# EAGLE design H12R10 (EAGLE 9.6.2)

## Sheet 1 of 2
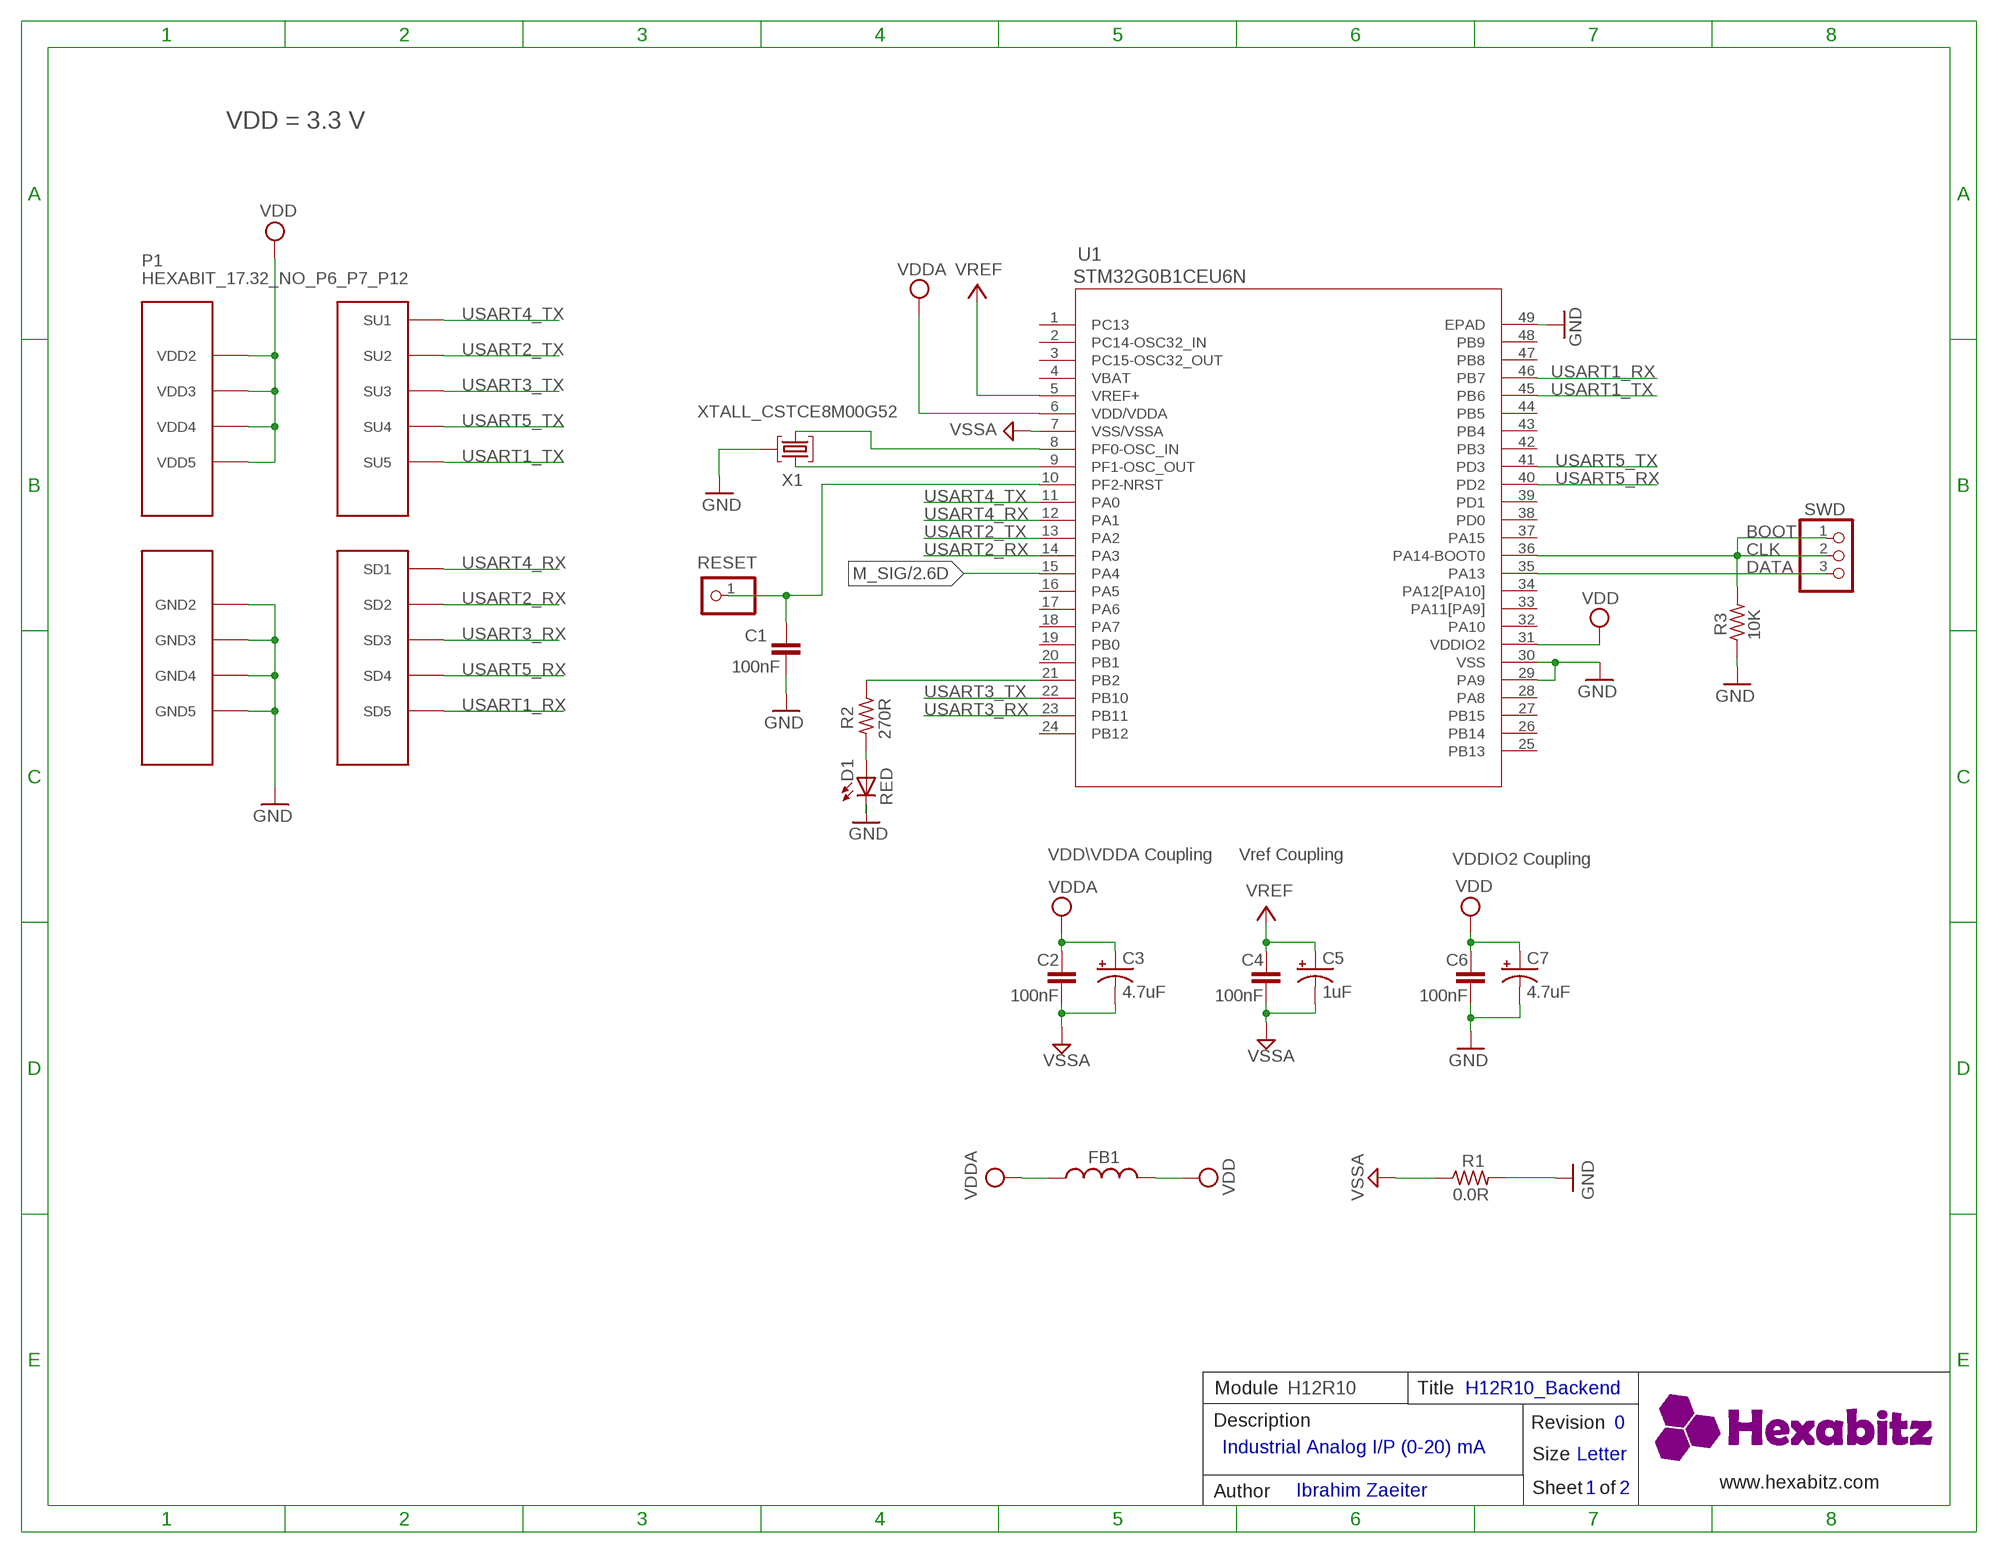
[diagram p0: schematic, sheet 1]

### Parts
C1  100nF  C-0603  [C-0603]
C2  100nF  C-0603  [C-0603]
C3  4.7uF  C-0805-POL  [C-0805-POL]
C4  100nF  C-0603  [C-0603]
C5  1uF  C-0805-POL  [C-0805-POL]
C6  100nF  C-0603  [C-0603]
C7  4.7uF  C-0805-POL  [C-0805-POL]
D1  RED  VLMS1300-GS08  [VLMS1300-GS08]
FB1  FB-0603  [FB-0603]
P1  HEXABIT_17.32_NO_P6_P7_P12  [HEXABIT_17.32_NO_P6_P7_P12]
R1  0.0R  R-0603  [R-0603]
R2  270R  R-0603  [R-0603]
R3  10K  R-0603  [R-0603]
RESET  R  PINHD-1X1  [1X01]
SWD  PINHD-1X3SWD  [SWD]
U1  STM32G0B1CEU6N  [HEXABITZ_ICS_QFN_B1CEU6_STM-L]
X1  XTALL_CSTCE8M00G52  [XTALL_CSTCE8M00G52]

### Nets
CLK: R3.2 SWD.1 SWD.2 U1.36(PA14-BOOT0)
DATA: SWD.3 U1.35(PA13)
GND: C1.2 C6.2 C7.2(-) D1.C P1.PAD_PD8(GND2) P1.PAD_PD9(GND3) P1.PAD_PD10(GND4) P1.PAD_PD11(GND5) R1.2 R3.1 U1.29(PA9) U1.30(VSS) U1.49(EPAD) X1.P$2
M_SIG: U1.15(PA4) ; also sheet 2
N$1: D1.A R2.2
N$4: R2.1 U1.21(PB2)
N$5: U1.9(PF1-OSC_OUT) X1.P$1
N$6: U1.8(PF0-OSC_IN) X1.P$3
N$8: C1.1 RESET.1 U1.10(PF2-NRST)
USART1_RX: P1.PAD_PD5(SD5) U1.46(PB7)
USART1_TX: P1.PAD_PU5(SU5) U1.45(PB6)
USART2_RX: P1.PAD_PD2(SD2) U1.14(PA3)
USART2_TX: P1.PAD_PU2(SU2) U1.13(PA2)
USART3_RX: P1.PAD_PD3(SD3) U1.23(PB11)
USART3_TX: P1.PAD_PU3(SU3) U1.22(PB10)
USART4_RX: P1.PAD_PD1(SD1) U1.12(PA1)
USART4_TX: P1.PAD_PU1(SU1) U1.11(PA0)
USART5_RX: P1.PAD_PD4(SD4) U1.40(PD2)
USART5_TX: P1.PAD_PU4(SU4) U1.41(PD3)
VDD: C6.1 C7.1(+) FB1.2 P1.PAD_PU8(VDD2) P1.PAD_PU9(VDD3) P1.PAD_PU10(VDD4) P1.PAD_PU11(VDD5) U1.31(VDDIO2)
VDDA: C2.1 C3.1(+) FB1.1 U1.6(VDD/VDDA) ; also sheet 2
VREF: C4.1 C5.1(+) U1.5(VREF+) ; also sheet 2
VSSA: C2.2 C3.2(-) C4.2 C5.2(-) R1.1 U1.7(VSS/VSSA) ; also sheet 2
Unconnected: U1.1(PC13) U1.2(PC14-OSC32_IN) U1.3(PC15-OSC32_OUT) U1.16(PA5) U1.17(PA6) U1.18(PA7) U1.19(PB0) U1.20(PB1) U1.24(PB12) U1.25(PB13) U1.26(PB14) U1.27(PB15) U1.28(PA8) U1.32(PA10) U1.33(PA11[PA9]) U1.34(PA12[PA10]) U1.37(PA15) U1.38(PD0) U1.39(PD1) U1.42(PB3) U1.43(PB4) U1.44(PB5) U1.47(PB8) U1.48(PB9)

### Notes on the sheet
- VDD = 3.3 V
- BOOT
- VDD\VDDA Coupling | Vref Coupling | VDDIO2 Coupling
- Module | H12R10 | Title | H12R10_Backend
- Description | Revision | 0
- Industrial Analog I/P (0-20) mA
- Size | Letter
- www.hexabitz.com
- Author | Ibrahim Zaeiter | Sheet   of | 1 | 2
- C:/Users/Admin/Desktop/logodraft.bmp

## Sheet 2 of 2
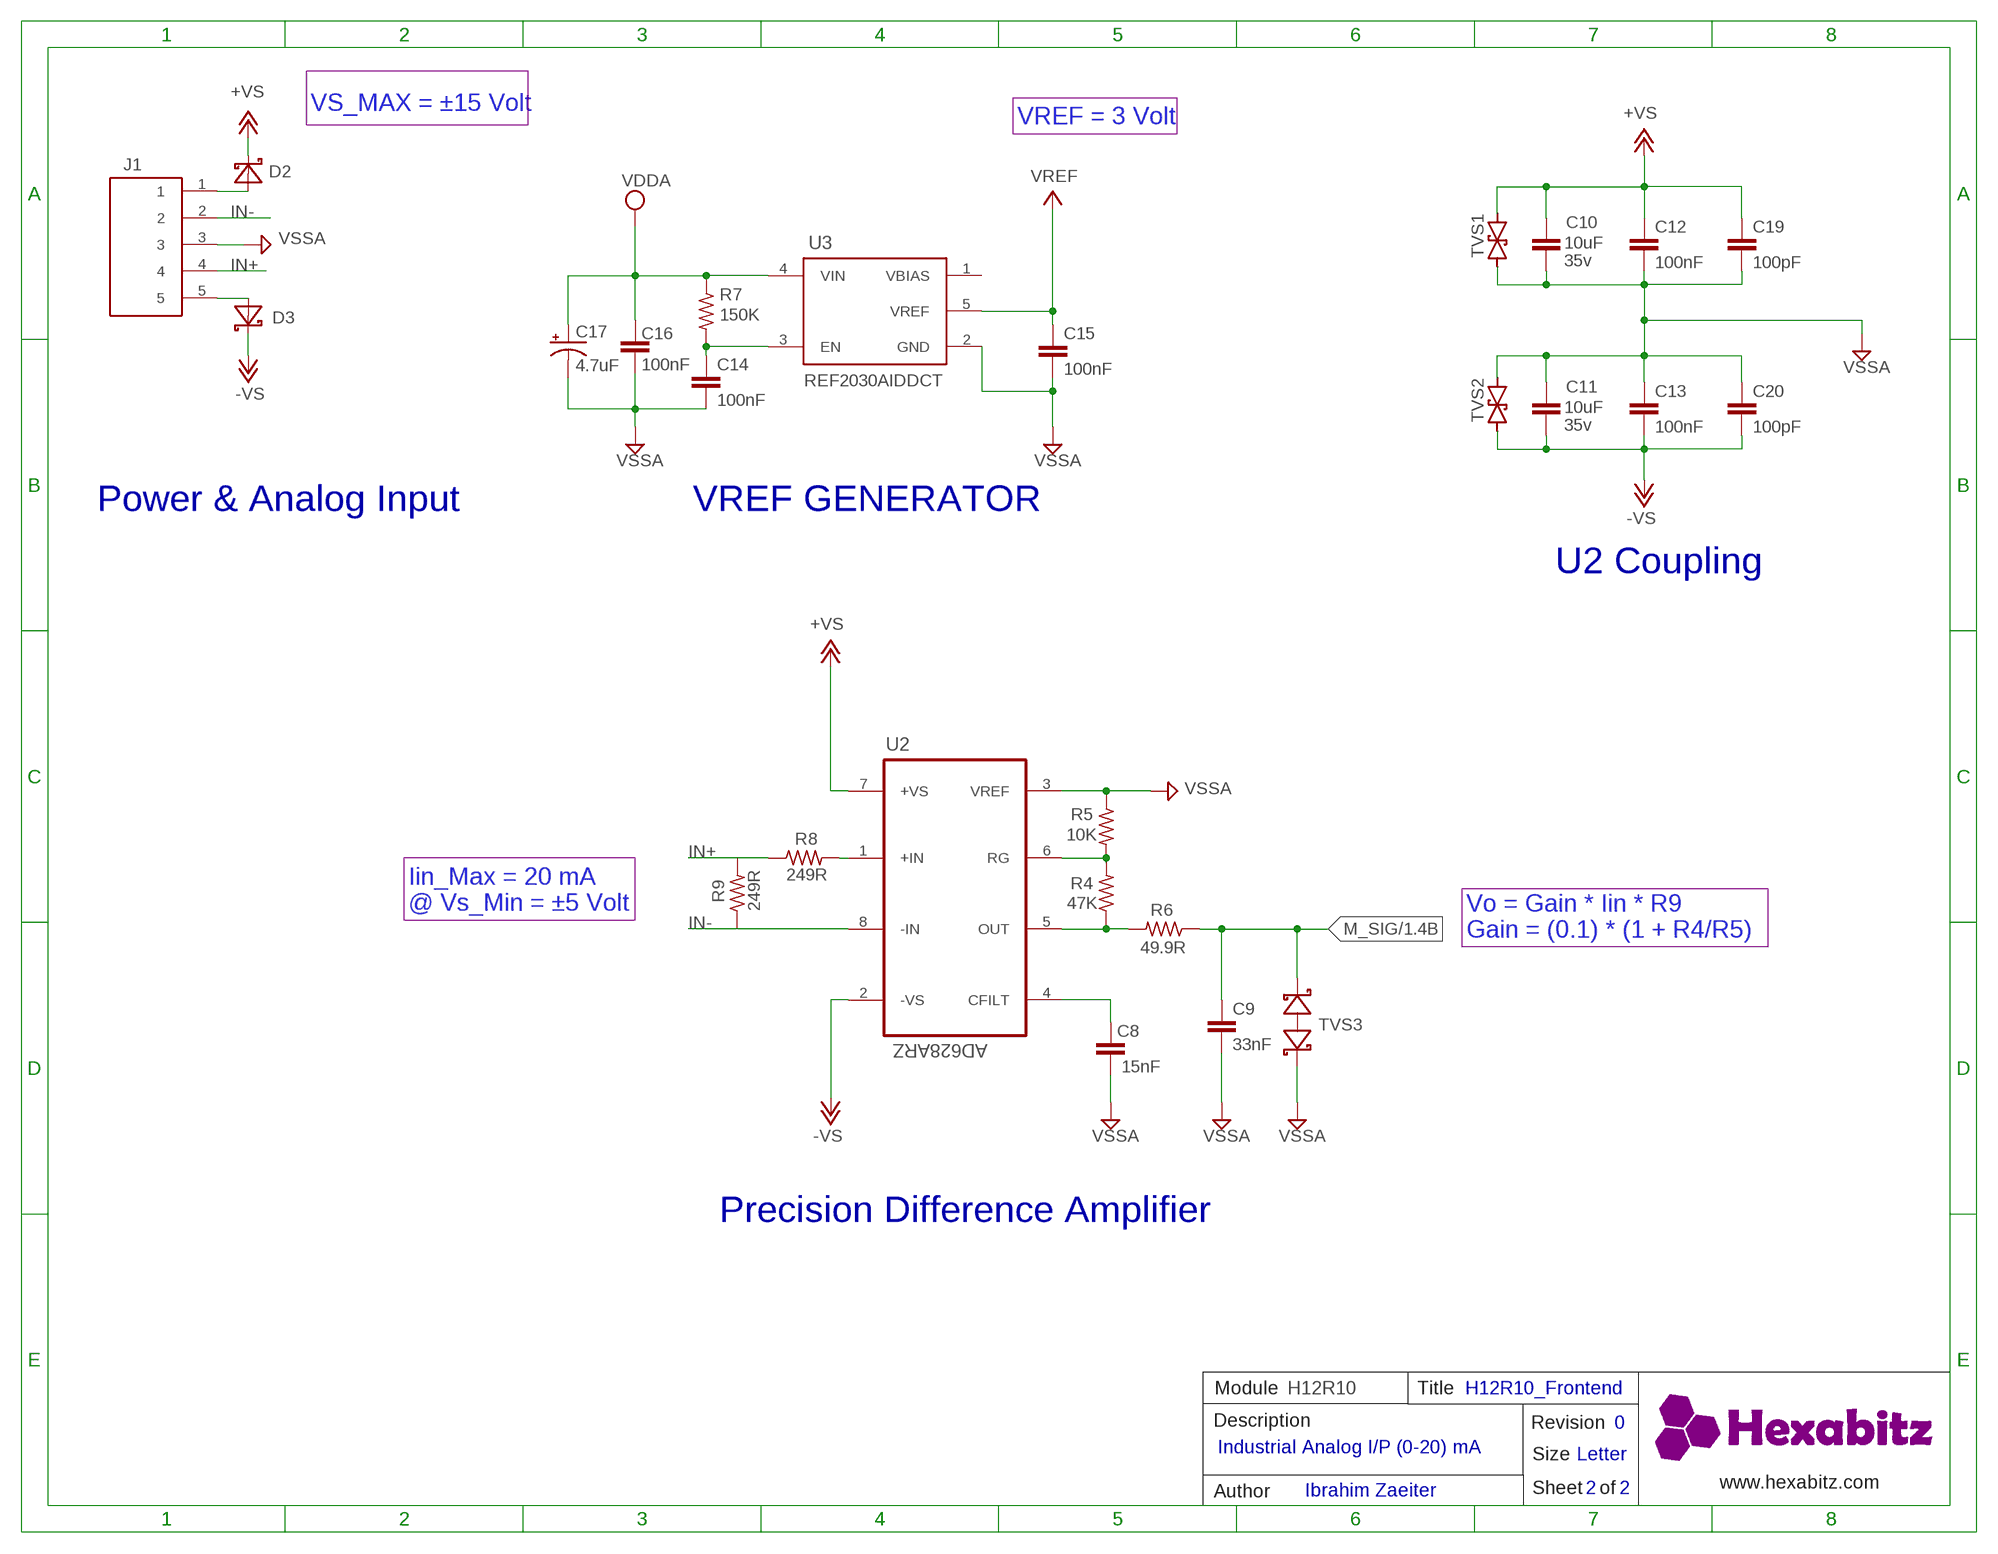
[diagram p1: schematic, sheet 2]

### Parts
C8  15nF  C-0603  [C-0603]
C9  33nF  C-0603  [C-0603]
C10  C-0805  [C-0805]
C11  C-0805  [C-0805]
C12  100nF  C-0603  [C-0603]
C13  100nF  C-0603  [C-0603]
C14  100nF  C-0603  [C-0603]
C15  100nF  C-0603  [C-0603]
C16  100nF  C-0603  [C-0603]
C17  4.7uF  C-0805-POL  [C-0805-POL]
C19  100pF  C-0603  [C-0603]
C20  100pF  C-0603  [C-0603]
D2  DIOD-SOD-123  [SOD123]
D3  DIOD-SOD-123  [SOD123]
J1  1984646  [1984646]
R4  47K  R-0603  [R-0603]
R5  10K  R-0603  [R-0603]
R6  49.9R  R-0603  [R-0603]
R7  150K  R-0603  [R-0603]
R8  249R  R-0603  [R-0603]
R9  249R  R-0603  [R-0603]
TVS1  SMBJ30CA  [DO214AA]
TVS2  SMBJ30CA  [DO214AA]
TVS3  BOURNS_CDSOD323-T03SCBOURNS_CDSOD323-T03SC_0_0  [BOURNS_CDSOD323-T03SC_0]
U2  AD628ARZ  [SOIC127P600X175-8N]
U3  TEXAS_INSTRUMENTS_REF2033AIDDCRTEXAS_INSTRUMENTS_REF2033AIDDCR_0_2  [TEXAS_INSTRUMENTS_REF2033AIDDCR_2]

### Nets
+VS: C10.1 C12.1 C19.1 D2.2(C) TVS1.C U2.7(+VS)
-VS: C11.2 C13.2 C20.2 D3.2(C) TVS2.A U2.2(-VS)
CFILT: C8.1 U2.4(CFILT)
IN+: J1.4 R8.1 R9.2
IN-: J1.2 R9.1 U2.8(-IN)
M_SIG: C9.1 R6.1 TVS3.2(C) ; also sheet 1
N$2: D3.1(A) J1.5
N$3: D2.1(A) J1.1
N$9: C14.1 R7.2 U3.3(EN)
N$10: R8.2 U2.1(+IN)
OUT: R4.1 R6.2 U2.5(OUT)
RG: R4.2 R5.2 U2.6(RG)
VDDA: C16.1 C17.1(+) R7.1 U3.4(VIN) ; also sheet 1
VREF: C15.1 U3.5(VREF) ; also sheet 1
VSSA: C8.2 C9.2 C10.2 C11.1 C12.2 C13.1 C14.2 C15.2 C16.2 C17.2(-) C19.2 C20.1 J1.3 R5.1 TVS1.A TVS2.C TVS3.1(A) U2.3(VREF) U3.2(GND) ; also sheet 1

### Notes on the sheet
- VS_MAX = ±15 Volt
- VREF = 3 Volt
- Power & Analog Input | VREF GENERATOR
- U2 Coupling
- Iin_Max = 20 mA
  @ Vs_Min = ±5 Volt
- Vo = Gain * Iin * R9
  Gain = (0.1) * (1 + R4/R5)
- Precision Difference Amplifier
- Module | H12R10 | Title | H12R10_Frontend
- Description | Revision | 0
- Industrial Analog I/P (0-20) mA
- Size | Letter
- www.hexabitz.com
- Author | Ibrahim Zaeiter | Sheet   of | 2 | 2
- C:/Users/Admin/Desktop/logodraft.bmp

## Power pins joined to a net without a drawn wire
VBAT: U1.4(VBAT)
VBIAS: U3.1(VBIAS)

## Library data of the parts
C1 C2 C4 C6 C8 C9 C14-C16 = HEXABITZ_RCLS:C-0603: CAP CER 10% X7R 0603
C3 C5 C7 C17 = HEXABITZ_RCLS:C-0805-POL: Cap Tant Solid SMD 2012
C10 C11 = HEXABITZ_RCLS:C-0805: CAP CER 10% X7R 0805; CAPACITANCE: 10uF; MPN: GRM21BR6YA106ME43K; VOLTAGE_RATING: 35v
C12 C13 C19 C20 = HEXABITZ_RCLS:C-0603: CAP CER 10% X7R 0603; MPN: C1608X7R1H104K080AA
D1 = Hexabitz:VLMS1300-GS08: Red 0603 130° Clear 54 mcd 2 V Surface Mount ChipLED ; Octopart Url : http://octopart.com/vlms1300-gs08-vishay-21709201; MFN: Vishay; MPN: VLMS1300-GS08; OCTOPART_URL: https://octopart.com/vlms1300-gs08-vishay-21709201?r=sp&s=_gcP4_q8T1SC6PJQPTQ9yA
D2 D3 = HEXABITZ_RCLS:DIOD-SOD-123: 1.0 A Surface Mount Schottky Barrier Rectifier, 40 V, -65 to 125 degC, 2-Pin SOD-123 Package, RoHS, Tape and Reel
FB1 = HEXABITZ_RCLS:FB-0603: Ferrite Beads Multi-Layer 0603
J1 = HEXABITZ_CONNECTION_PARTS:1984646: Phoenix Contact, COMBICON PT 3.5mm Pitch, 5 Way PCB Terminal Strip Source: Datasheet <https://datasheet.datasheetarchive.com/originals/distributors/Datasheets-DGA17/1074867.pdf>; DESCRIPTION: Phoenix Contact, COMBICON PT 3.5mm Pitch, 5 Way PCB Terminal Strip; HEIGHT: 9.3mm; MANUFACTURER_NAME: Phoenix Contact; MANUFACTURER_PART_NUMBER: 1984646; MOUSER_PART_NUMBER: 651-1984646; MOUSER_PRICE-STOCK: https://www.mouser.co.uk/ProductDetail/Phoenix-Contact/1984646?qs=g1oZCf%252BoH3xdW03%252BzJvi0Q%3D%3D
P1 = hexabitz_connectors:HEXABIT_?_NO_P6_P7_P12: Hexabitz Hexagon Module Connector Hexagon side length = 17.32mm. The following ports are removed: P6 P7 P12
R1-R9 = HEXABITZ_RCLS:R-0603: Thick Film Resistors - SMD 0603
RESET = HEXABITZ_USER_INTERFACE_PARTS:PINHD-1X1: PIN HEADER; MFN: TE Connectivity; MPN: 87227-1; OCTOPART_URL: https://octopart.com/87227-1-te+connectivity-39512052?r=sp
SWD = HEXABITZ_CONNECTION_PARTS:PINHD-1X3: PIN HEADER
TVS1 TVS2 = HEXABITZ_RCLS:SMBJ30CA: TVS Diode; MFN: ON Semiconductor; MPN: SMBJ30CA; OCTOPART_URL: https://octopart.com/smbj30ca-on+semiconductor-84331460?r=sp&s=Vl5BdVYHQCeKmKgfbE4rMg
TVS3 = HEXABITZ_RCLS:BOURNS_CDSOD323-T03SC: CDSOD323-TxxSC - TVS Diode Series; DESCRIPTION: Dio Tvs Vwm 03V 500W Bidir Sod323 / Tape & Reel - 7" Reel; MFN: Bourns; MPN: CDSOD323-T03SC; OCTOPART_URL: https://octopart.com/cdsod323-t03sc-bourns-10487153?r=sp
U1 = HEXABITZ_ICs:STM32G0B1CEU6N
U2 = HEXABITZ_ICs:AD628ARZ: High Common-Mode Voltage,Programmable Gain Difference Amplifier; DESCRIPTION: Operational amplifier; 600kHz; 2.25÷36VDC; Channels: 1;; MFN: Analog Devices; MPN: AD628ARZ; OCTOPART_URL: https://octopart.com/ad628arz-analog+devices-410882
U3 = HEXABITZ_ICs:TEXAS_INSTRUMENTS_REF2033AIDDCR: V-Ref Precision 3.3V 20mA 5-Pin TSOT-23 T/R; DESCRIPTION: Low-Drift, Low-Power, Dual-Output Vref and Vref/2 Voltage Reference 5-SOT-23-THIN -40 to 125; MFN: Texas Instruments; MPN: REF2030AIDDCT; OUTPUT_VOLTAGE: 1.5/3.0V
X1 = HEXABITZ_RCLS:XTALL_CSTCE8M00G52: MURATA CSTCE8M00G52-R0 RESONATOR, SMD, 8MHZ ; Octopart Url : https://octopart.com/cstce8m00g52-r0-murata-7145559; MFN: Murata; MPN: CSTCE8M00G52Z-R0; OCTOPART_URL: https://octopart.com/cstce8m00g52z-r0-murata-17755941?r=sp&s=JDnNJnrHQhyS8Zk4ofFWXw

## Board
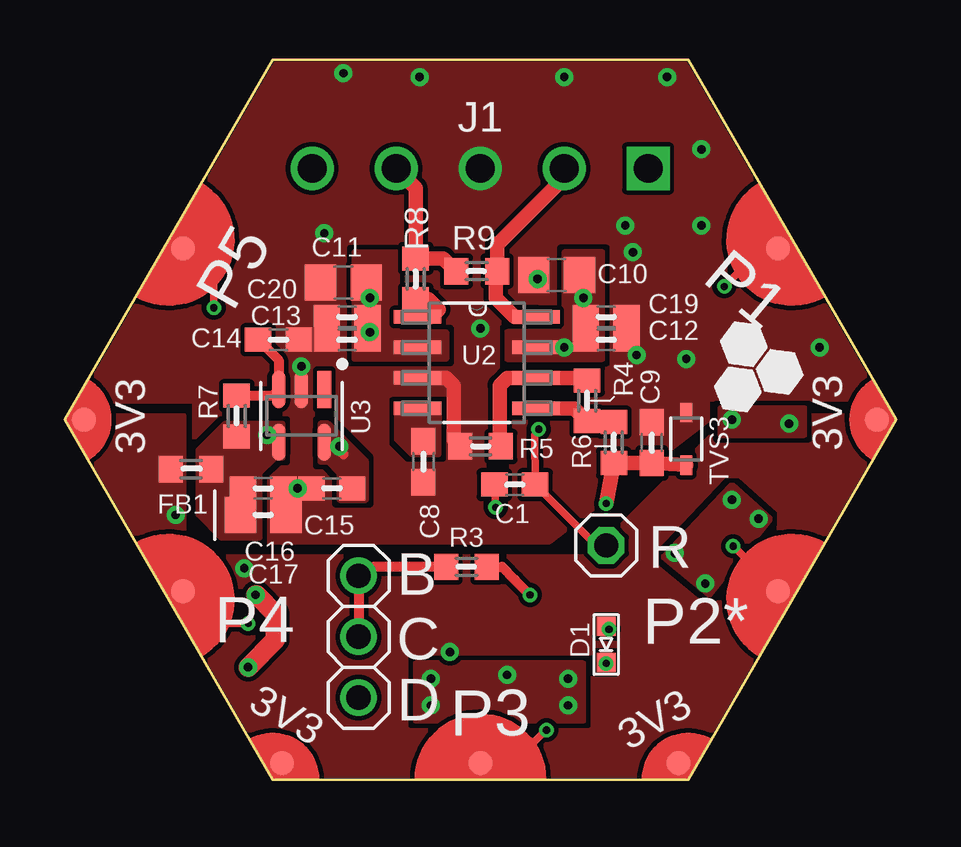
[diagram p2: board, top side]
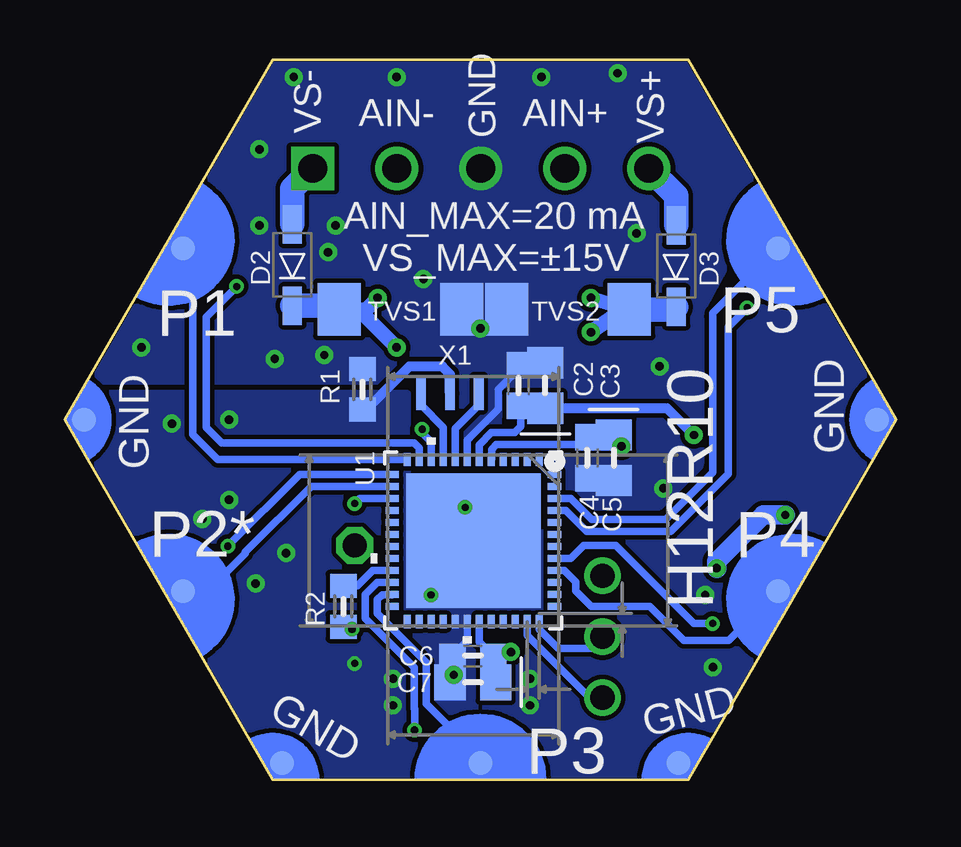
[diagram p3: board, bottom side, seen from below]

Size 34.64 x 30 mm. Coordinates in mm from the lower left corner, seen from the top.
Copper layers (1*16): Top 0.035mm / dielectric 1.5mm / Bottom 0.035mm
Design rules "default *": minimum track width 6mil, minimum drill 0.3mm, track to track 7.5mil, track to pad 7.5mil, pad to pad 7.5mil, via to via 7.5mil, smd to smd 0mil, copper to edge 1mil, drill to drill 6mil, minimum pad ring 10mil, minimum via ring 6mil, stop-mask expansion 4mil, vias tented up to drill 24mil, thermal gap 10mil

### Footprints (pad centres in the part's own frame; a part is rotated, then mirrored left to right if it is on the bottom)
C-0603 = smd 1.1 x 1: 1 -0.85,0; 2 0.85,0
C-0805-POL = smd 1.3 x 1.5: 1 -0.95,0; 2 0.95,0
C-0805 = smd 1.3 x 1.5: 1 -0.95,0; 2 0.95,0
VLMS1300-GS08 = smd 0.8 x 0.8: A 0,0.75; C 0,-0.75
SOD123 = smd 1.6 x 0.8: 1 -1.7,0; 2 1.7,0
FB-0603 = smd 1 x 1.1: 1 -0.85,0; 2 0.85,0
1984646 = drill 1.2 pad 1.8 square: 1 0,0 | drill 1.2 pad 1.8: 2 3.5,0; 3 7,0; 4 10.5,0; 5 14,0
HEXABIT_17.32_NO_P6_P7_P12 = smd 1 x 1 bottom: PAD_PD1 12.39,7.15; PAD_PD2 12.39,-7.15; PAD_PD3 0,-14.31; PAD_PD4 -12.39,-7.15; PAD_PD5 -12.39,7.15; PAD_PD8 16.52,0; PAD_PD9 8.26,-14.31; PAD_PD10 -8.26,-14.31; PAD_PD11 -16.52,0 | smd 1 x 1: PAD_PU1 12.39,7.15; PAD_PU2 12.39,-7.15; PAD_PU3 0,-14.31; PAD_PU4 -12.39,-7.15; PAD_PU5 -12.39,7.15; PAD_PU8 16.52,0; PAD_PU9 8.26,-14.31; PAD_PU10 -8.26,-14.31; PAD_PU11 -16.52,0
R-0603 = smd 1 x 1.1: 1 -0.85,0; 2 0.85,0
1X01 = drill 1.016 octagon: 1 0,0
SWD = drill 1.016: 1 -2.54,0; 2 0,0; 3 2.54,0
DO214AA = smd 1.8 x 2.2: A 2.55,0; C -2.55,0
BOURNS_CDSOD323-T03SC_0 = smd 0.8 x 0.5: 1 -1.1,0; 2 1.1,0
HEXABITZ_ICS_QFN_B1CEU6_STM-L = smd 0.55 x 0.297: 1 -3.38,2.751; 2 -3.38,2.251; 3 -3.38,1.75; 4 -3.38,1.25; 5 -3.38,0.75; 6 -3.38,0.25; 7 -3.38,-0.25; 8 -3.38,-0.75; 9 -3.38,-1.25; 10 -3.38,-1.75; 11 -3.38,-2.251; 12 -3.38,-2.751; 25 3.38,-2.751; 26 3.38,-2.251; 27 3.38,-1.75; 28 3.38,-1.25; 29 3.38,-0.75; 30 3.38,-0.25; 31 3.38,0.25; 32 3.38,0.75; 33 3.38,1.25; 34 3.38,1.75; 35 3.38,2.251; 36 3.38,2.751 | smd 0.297 x 0.55: 13 -2.751,-3.38; 14 -2.251,-3.38; 15 -1.75,-3.38; 16 -1.25,-3.38; 17 -0.75,-3.38; 18 -0.25,-3.38; 19 0.25,-3.38; 20 0.75,-3.38; 21 1.25,-3.38; 22 1.75,-3.38; 23 2.251,-3.38; 24 2.751,-3.38; 37 2.751,3.38; 38 2.251,3.38; 39 1.75,3.38; 40 1.25,3.38; 41 0.75,3.38; 42 0.25,3.38; 43 -0.25,3.38; 44 -0.75,3.38; 45 -1.25,3.38; 46 -1.75,3.38; 47 -2.251,3.38; 48 -2.751,3.38 | smd 5.6 x 5.6: 49 0,0
SOIC127P600X175-8N = smd 1.981 x 0.559: 1 -2.464,1.905; 2 -2.464,0.635; 3 -2.464,-0.635; 4 -2.464,-1.905; 5 2.464,-1.905; 6 2.464,-0.635; 7 2.464,0.635; 8 2.464,1.905
TEXAS_INSTRUMENTS_REF2033AIDDCR_2 = smd 1.554 x 0.572: 1 -1.1,0.95; 2 -1.1,0; 3 -1.1,-0.95; 4 1.1,-0.95; 5 1.1,0.95
XTALL_CSTCE8M00G52 = smd 1.4 x 0.4: P$1 0,1.2; P$2 0,0; P$3 0,-1.2

### Placement (x,y rotation side)
C1  18.75,12.3 180 top
C2  15.73,16.43 90 bottom
C3  14.62,16.43 90 bottom
C4  12.88,13.41 270 bottom
C5  11.76,13.41 270 bottom
C6  17.64,5.16 180 bottom
C7  17.64,4.05 180 bottom
C8  14.94,13.25 270 top
C9  24.46,14.05 90 top
C10  20.5,21.03 180 top
C11  11.61,20.71 0 top
C12  22.56,18.33 0 top
C13  11.76,18.33 0 top
C14  8.91,18.33 0 top
C15  11.13,12.14 180 top
C16  8.27,12.14 0 top
C17  8.27,11.03 0 top
C19  22.56,19.29 0 top
C20  11.76,19.29 0 top
D1  22.56,5.63 0 top
D2  25.16,21.45 270 bottom
D3  9.17,21.41 270 bottom
FB1  5.26,12.94 180 top
J1  24.3,25.48 180 top
P1  17.32,15 0 top
R1  22.24,16.27 270 bottom
R2  23.04,7.22 270 bottom
R3  16.74,8.86 180 top
R4  21.77,15.79 90 top
R5  17.32,13.89 0 top
R6  22.88,14.05 90 top
R7  7.16,15.16 90 top
R8  14.62,20.87 270 top
R9  17.16,21.19 180 top
RESET  22.56,9.76 90 top
SWD  12.24,5.95 270 top
TVS1  20.65,19.6 0 bottom
TVS2  13.67,19.6 0 bottom
TVS3  25.89,14.21 270 top
U1  17.62,9.97 270 bottom
U2  17.16,17.38 0 top
U3  9.86,15.16 270 top
X1  18.59,16.11 90 bottom

### Tracks (layer width: path | path; a pad name or v marks a point on that pad's centre or on a via)
+VS  (via drill 0.35 pad 0.75)
  Bottom 0.61: v21.61,20.08 22.08,19.6 TVS1.C 22.4,19.6 v20.81,18.02
  Bottom 1.016: D2.2 23.35,19.75 TVS1.C
  pour Top (no thermals): 18.43,18.65 18.43,17.54 22.4,17.54 22.4,21.98 20.81,21.98 20.81,18.65
-VS  (via drill 0.35 pad 0.75)
  Bottom 0.61: v12.72,20.08 TVS2.A 11.38,19.6 v12.72,18.65
  Bottom 1.016: TVS2.A 9.27,19.6 D3.2
  pour Top (no thermals): 15.89,18.65 15.89,17.54 12.08,17.54 12.08,21.98 13.83,21.98 13.83,18.65
CFILT
  pour Top (no thermals): 13.83,15.63 13.83,14.21 14.46,13.57 15.57,13.57 15.57,14.84 15.73,15 15.73,15.63
CLK
  Top 0.406: SWD.2 SWD.1 12.37,8.36 12.88,8.86 R3.2
  Bottom 0.305: U1.36 14.87,6.27 14.07,5.47 12.72,5.47 SWD.2
DATA
  Bottom 0.305: U1.35 15.36,6.01 12.76,3.41 SWD.3
GND  (via drill 0.3 pad 0.55, 0.35 pad 0.75)
  Top 0.305: C1.2 v17.96,11.35 | D1.C v22.56,4.84
  Top 0.406: R3.1 18.23,8.86 18.76,8.33 18.76,8.32 v19.38,7.7
  Top 0.813: v7.95,7.7 7.99,7.7 8.78,6.91 8.78,5.82 v7.64,4.68
  Bottom 0.254: U1.49 17.62,11.01 v17.96,11.35
  Bottom 0.305: U1.30 17.87,5.78 C6.2
  Bottom 0.406: X1.P$2 18.59,16.9 18.91,17.22 20.28,17.22 22.08,15.42 R1.2
  Bottom 0.508: C6.2 18.49,4.15 C7.2
  other vias: 27.8,15 30.18,14.84 28.91,10.87 27.8,11.67 26.69,8.17 25.42,9.44 20.97,4.2 20.97,3.09 15.26,4.2 15.26,3.09 18.43,4.36
  pour Bottom (no thermals): 21.13,16.27 21.29,16.11 33.99,16.11 34.62,15 25.89,0.08 8.75,0.08 0.02,15 3.03,20.08 7.64,20.08 7.64,12.78 10.11,10.3 20.34,10.3 20.34,16.11 21.13,16.11
  pour Top (no thermals): 27.32,15.48 27.32,14.36 30.81,14.36 30.81,15.48
  pour Top (no thermals): 27.8,12.3 29.38,10.87 26.84,7.7 24.94,9.29
  pour Top (no thermals): 14.62,4.84 14.62,2.46 21.61,2.46 21.61,4.84
IN+
  Top 0.61: J1.4 14.62,24.66 R8.1 15.78,21.72 R9.2
IN-
  Top 0.61: J1.2 20.8,25.1 18.01,22.3 R9.1 17.96,21.13 17.96,20.08 18.75,19.29 U2.8
M_SIG  (via drill 0.3 pad 0.55)
  Top 0.61: TVS3.2 C9.1 R6.1 v22.56,11.51
  Bottom 0.305: v22.56,11.51 22.35,11.72 U1.15
N$1  (via drill 0.3 pad 0.55)
  Top 0.305: v22.68,6.27 D1.A
  Bottom 0.305: R2.2 22.78,6.37 v22.68,6.27
N$2
  Bottom 1.016: J1.5 9.17,24.34 D3.1
N$3
  Bottom 1.016: J1.1 25.16,24.63 D2.1
N$4
  Bottom 0.305: U1.21 21.81,8.72 22.45,8.07 R2.1
N$5
  Bottom 0.305: X1.P$1 19.79,15.61 18.87,14.69 U1.9
N$6
  Bottom 0.305: X1.P$3 17.39,15.61 18.37,14.63 U1.8
N$8  (via drill 0.3 pad 0.55)
  Top 0.305: v19.75,14.6 19.75,14.53 19.59,14.37 C1.1 22.07,9.83 22.5,9.83 RESET.1
  Bottom 0.305: v19.75,14.6 19.75,14.44 19.37,14.06 U1.10
N$9
  Top 0.406: R7.2 8.66,16.01 U3.3 8.91,17.48 C14.1
N$10
  Top 0.61: R8.2 15.15,20.02 15.57,19.6 15.26,19.29 U2.1
OUT
  Top 0.406: R4.1 22.83,14.94 R6.2
  Top 0.61: U2.5 21.23,15.48 R4.1
RG
  Top 0.61: R4.2 21.66,16.75 U2.6 18.43,16.75 18.11,16.43 18.11,13.94 R5.2
USART1_RX
  Bottom 0.305: P1.PAD_PD5 7.64,19.44 7.64,12.8 9.6,10.83 12.68,10.83 13.56,11.72 U1.46
USART1_TX  (via drill 0.3 pad 0.55)
  Top 0.305: P1.PAD_PU5 6.21,20.87 v6.21,19.66
  Bottom 0.305: v6.21,19.66 7,18.87 7,12.73 9.4,10.34 12.89,10.34 13.76,11.22 U1.45
USART2_RX
  Bottom 0.305: U1.14 22.25,12.22 22.26,12.23 24.38,12.23 27.12,9.48 27.12,9.43 28.71,7.85 P1.PAD_PD2
USART2_TX  (via drill 0.3 pad 0.55)
  Top 0.305: v27.85,9.73 29.71,7.87 P1.PAD_PU2
  Bottom 0.305: U1.13 22.05,12.72 24.86,12.72 v27.85,9.73
USART3_RX
  Bottom 0.305: U1.23 21.01,7.71 21.41,7.71 21.62,7.51 21.62,6.92 19.58,4.89 19.58,3.15 17.32,0.89 P1.PAD_PD3
USART3_TX  (via drill 0.3 pad 0.55)
  Top 0.305: v20.07,2.07 18.69,0.69 P1.PAD_PU3
  Bottom 0.305: U1.22 21.61,8.21 22.11,7.71 22.11,6.72 20.08,4.68 20.08,2.95 20.07,2.94 v20.07,2.07
USART4_RX
  Bottom 0.305: U1.12 28.27,13.35 29.31,14.38 29.31,21.75 P1.PAD_PD1
USART4_TX  (via drill 0.3 pad 0.55)
  Top 0.305: v27.48,20.56 29.07,22.15 P1.PAD_PU1
  Bottom 0.305: U1.11 19.87,13.82 20.07,14.03 28.1,14.03 28.75,14.67 28.75,19.29 v27.48,20.56
USART5_RX
  Bottom 0.305: P1.PAD_PD4 6.98,5.8 8.85,5.8 10.28,7.23 12.7,7.23 13.35,7.87 13.35,8.23 13.83,8.72 U1.40
USART5_TX  (via drill 0.3 pad 0.55)
  Top 0.305: v7.64,6.51 6.27,6.51 P1.PAD_PU4
  Bottom 0.305: U1.41 13.55,9.22 13.02,9.75 11.68,9.75 8.44,6.51 v7.64,6.51
VDD  (via drill 0.35 pad 0.75)
  Bottom 0.305: U1.31 17.37,5.74 C6.1
  Bottom 0.406: C6.1 16.21,5.16 v16.05,5.32
  Bottom 0.508: C6.1 16.79,4.15 C7.1
  Bottom 0.813: v7.48,8.81 7.48,9.09 5.54,11.03 v4.62,11.03
  pour Top (rank 3, no thermals): -0.14,15.16 4.94,15.16 4.94,9.6 5.26,9.29 21.92,9.29 27.48,14.84 27.8,14.84 28.12,15.16 34.47,15.16 34.62,15 25.89,0.08 8.59,0.08
VDDA  (via drill 0.35 pad 0.75)
  Bottom 0.305: C3.1 15.63,15.48 | 15.63,15.48 C2.1 | 15.63,15.48 15.63,14.72 15.89,14.46 16.86,14.46 17.37,13.95 U1.6
  Bottom 0.406: v8.43,14.36 9.54,15.48 C3.1
  pour Top (no thermals): 8.11,10.08 6.53,10.08 5.57,11.03 5.57,13.73 6.68,14.84 9.06,14.84 9.06,13.41 8.75,13.41 8.11,12.78
VREF  (via drill 0.35 pad 0.75)
  Top 0.406: v11.45,13.89 11.45,13.73 11.61,13.57
  Bottom 0.305: U1.5 16.86,13.35 16.86,13.76 16.66,13.96 13.17,13.96 C4.1
  Bottom 0.406: v11.45,13.89 11.76,14.21 C5.1 11.86,14.26 C4.1
  pour Top (no thermals): 10.65,14.84 10.65,13.25 10.97,13.25 11.45,12.78 11.45,11.67 12.56,11.67 12.56,13.25 10.97,14.84
VSSA  (via drill 0.35 pad 0.75)
  Top 0.61: U2.3 15.89,16.75 16.21,16.43 16.21,14.15 R5.1
  Bottom 0.305: U1.7 17.87,14.16 16.57,15.45 16.57,16.27 15.73,17.11 C2.2
  other vias: 25.1,29.29 20.81,29.29 14.78,29.29 11.61,29.45 26.53,26.27 10.81,22.78 23.35,23.1 19.7,20.87 17.32,18.81 9.86,17.22 23.83,17.7 25.89,17.54 23.67,21.98 26.53,23.1 9.7,12.14 31.45,18.02
  pour Top (rank 2, no thermals): 26.07,29.92 8.43,29.92 8.43,29.92 4.13,23.48 0.02,15.79 5.41,15.79 5.41,9.92 20.18,9.92 26.78,15 26.78,15.88 34.18,15.88 31.92,20.44 26.07,29.92
  pour Bottom (rank 2, no thermals): 2.4,30.08 26.05,30.08 33.45,17 33.04,16.59 20.18,16.59 14.94,11.35 9.86,11.35 8.15,13.06 7.87,14.47 8.11,19.44 8.11,19.45

### Text on the board
tPlace: P1 | P5 | 3V3 | 3V3 | P4 | P2* | 3V3 | P3 | 3V3
bPlace: H12R10 | P3
bNames: VS+ | VS- | AIN+ | GND | AIN- | AIN_MAX=20 mA | P5 | VS_MAX=±15V | P1 | GND | GND | P4 | P2* | GND | GND